# Altium schematic sheet IC_BNO080.SchDoc
size A
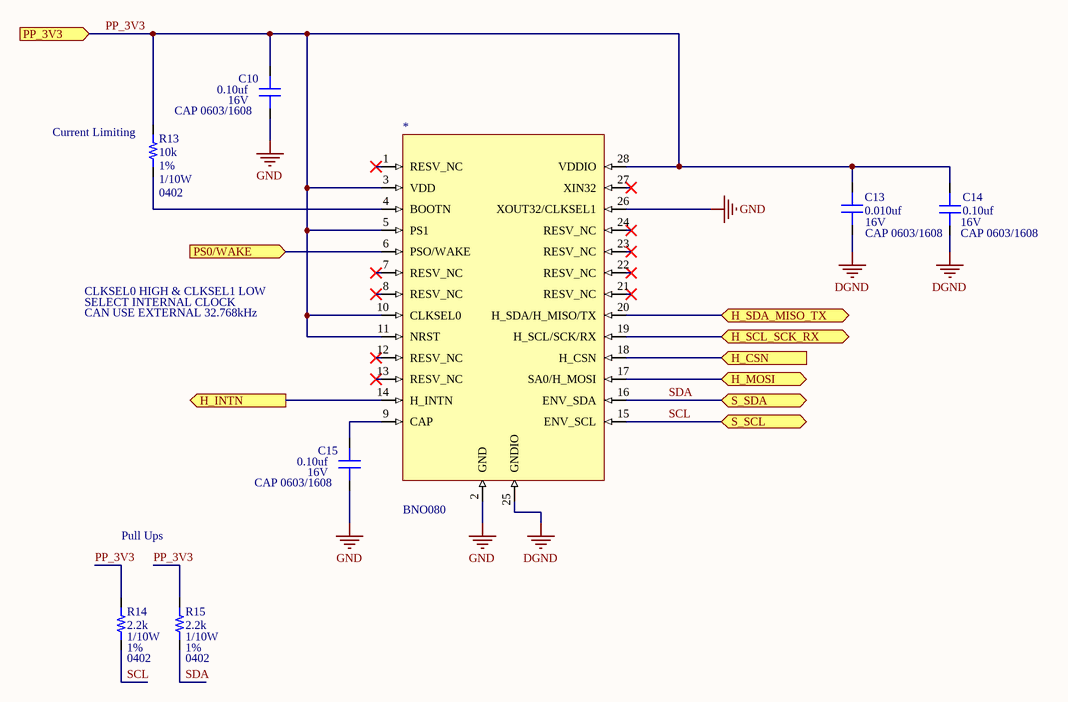
[diagram p0: IC_BNO080.SchDoc]

## Parts
*  BNO080  [BNO080]
C10  value 0.10uf  Voltage_Rating: 16V  [CAP 0603/1608]  (hidden comment: Capacitor MLCC 0.10uf 16V CAP 0603/1608)
C13  value 0.010uf  Voltage_Rating: 16V  [CAP 0603/1608]  (hidden comment: Capacitor MLCC 0.010uf 16V CAP 0603/1608)
C14  value 0.10uf  Voltage_Rating: 16V  [CAP 0603/1608]  (hidden comment: Capacitor MLCC 0.10uf 16V CAP 0603/1608)
C15  value 0.10uf  Voltage_Rating: 16V  [CAP 0603/1608]  (hidden comment: Capacitor MLCC 0.10uf 16V CAP 0603/1608)
R13  value 10k  Tolerance: 1%  Power: 1/10W  Package: 0402  [RES 0402/1005]  (hidden comment: Resistor 10k 0402 1/10W 1%)
R14  value 2.2k  Tolerance: 1%  Power: 1/10W  Package: 0402  [RES 0402/1005]  (hidden comment: Resistor 2.2k 0402 1/10W 1%)
R15  value 2.2k  Tolerance: 1%  Power: 1/10W  Package: 0402  [RES 0402/1005]  (hidden comment: Resistor 2.2k 0402 1/10W 1%)

## Ports
H_CSN (in), H_INTN (out), H_MOSI (bidir), H_SCL_SCK_RX (bidir), H_SDA_MISO_TX (bidir), PP_3V3 (in), PS0/WAKE (in), S_SCL (bidir), S_SDA (bidir)

## Nets
DGND: *.25(GNDIO) C13.1 C14.1
GND: *.2(GND) *.26(XOUT32/CLKSEL1) C10.1 C15.1
H_CSN: *.18(H_CSN) ; port H_CSN
H_INTN: *.14(H_INTN) ; port H_INTN
H_MOSI: *.17(SA0/H_MOSI) ; port H_MOSI
H_SCL_SCK_RX: *.19(H_SCL/SCK/RX) ; port H_SCL_SCK_RX
H_SDA_MISO_TX: *.20(H_SDA/H_MISO/TX) ; port H_SDA_MISO_TX
PP_3V3: *.3(VDD) *.5(PS1) *.10(CLKSEL0) *.11(NRST) *.28(VDDIO) C10.2 C13.2 C14.2 R13.2 R14.2 R15.2 ; port PP_3V3
PS0/WAKE: *.6(PSO/WAKE) ; port PS0/WAKE
SCL: *.15(ENV_SCL) R14.1 ; port S_SCL
SDA: *.16(ENV_SDA) R15.1 ; port S_SDA
Net*_4: *.4(BOOTN) R13.1
Net*_9: *.9(CAP) C15.2

Not connected (* = marked no-connect by the designer): * 1(RESV_NC)* 7(RESV_NC)* 8(RESV_NC)* 12(RESV_NC)* 13(RESV_NC)* 21(RESV_NC)* 22(RESV_NC)* 23(RESV_NC)* 24(RESV_NC)* 27(XIN32)*

## Notes on the sheet
- (near R13) Current Limiting
- CLKSEL0 HIGH & CLKSEL1 LOW
- SELECT INTERNAL CLOCK
- CAN USE EXTERNAL 32.768kHz
- Pull Ups

## Library data of the parts
* = 33: Accelerometer, Gyroscope, Magnetometer, 9 Axis Sensor; Manufacturer_id: 1; idIC_Misc: 33; Value: Null; Vin(Min): 1.7V for IO, 2.4V for sensors; Vin(Max): 3.6V; MfrPartNo: BNO080; Drawer_id: 1; Name: BNO080; Type: 9dof IC Sensor; Protocol: Null; Num_Circuits: 1; Data_Rate: Null; Package: 28-TFLGA; ComponentLink1Description: datasheet; ComponentLink1URL: https://cdn.sparkfun.com/assets/1/3/4/5/9/BNO080_Datasheet_v1.3.pdf; Supplier1: Digi-Key; Supplier1PartNo: https://www.digikey.com/product-detail/en/hillcrest-laboratories-inc/BNO080/1888-1000-1-ND/7917169; Created_By: Null; Updated_By: Null
C10 C14 C15 = 223: Manufacturer_id: 1; idCapacitor: 223; Name: Cap_0.10uf_16V_CAP 0603/1608; Dielectric: Ceramic; Created_By: Nick Mah; Drawer_id: 1; Package: CAP 0603/1608; Created_Date: 10/20/2018
C13 = 217: Manufacturer_id: 1; idCapacitor: 217; Name: Cap_0.010uf_16V_CAP 0603/1608; Dielectric: Ceramic; Created_By: Nick Mah; Drawer_id: 1; Package: CAP 0603/1608; Created_Date: 10/20/2018
R13 = 97: Manufacturer_id: 1; idResistor: 97; Name: Res_10k_0402_1/10W_1%; Created_By: Nick Mah; Supplier 1: Digi-Key; Drawer_id: 1; ComponentLink1Description: Datasheet; Created_Date: 2018-10-20
R14 R15 = 81: Manufacturer_id: 1; idResistor: 81; Name: Res_2.2k_0402_1/10W_1%; Created_By: Nick Mah; Supplier 1: Digi-Key; Drawer_id: 1; ComponentLink1Description: Datasheet; Created_Date: 2018-10-20